# EAGLE design asam1.4 (EAGLE 6.6.0)
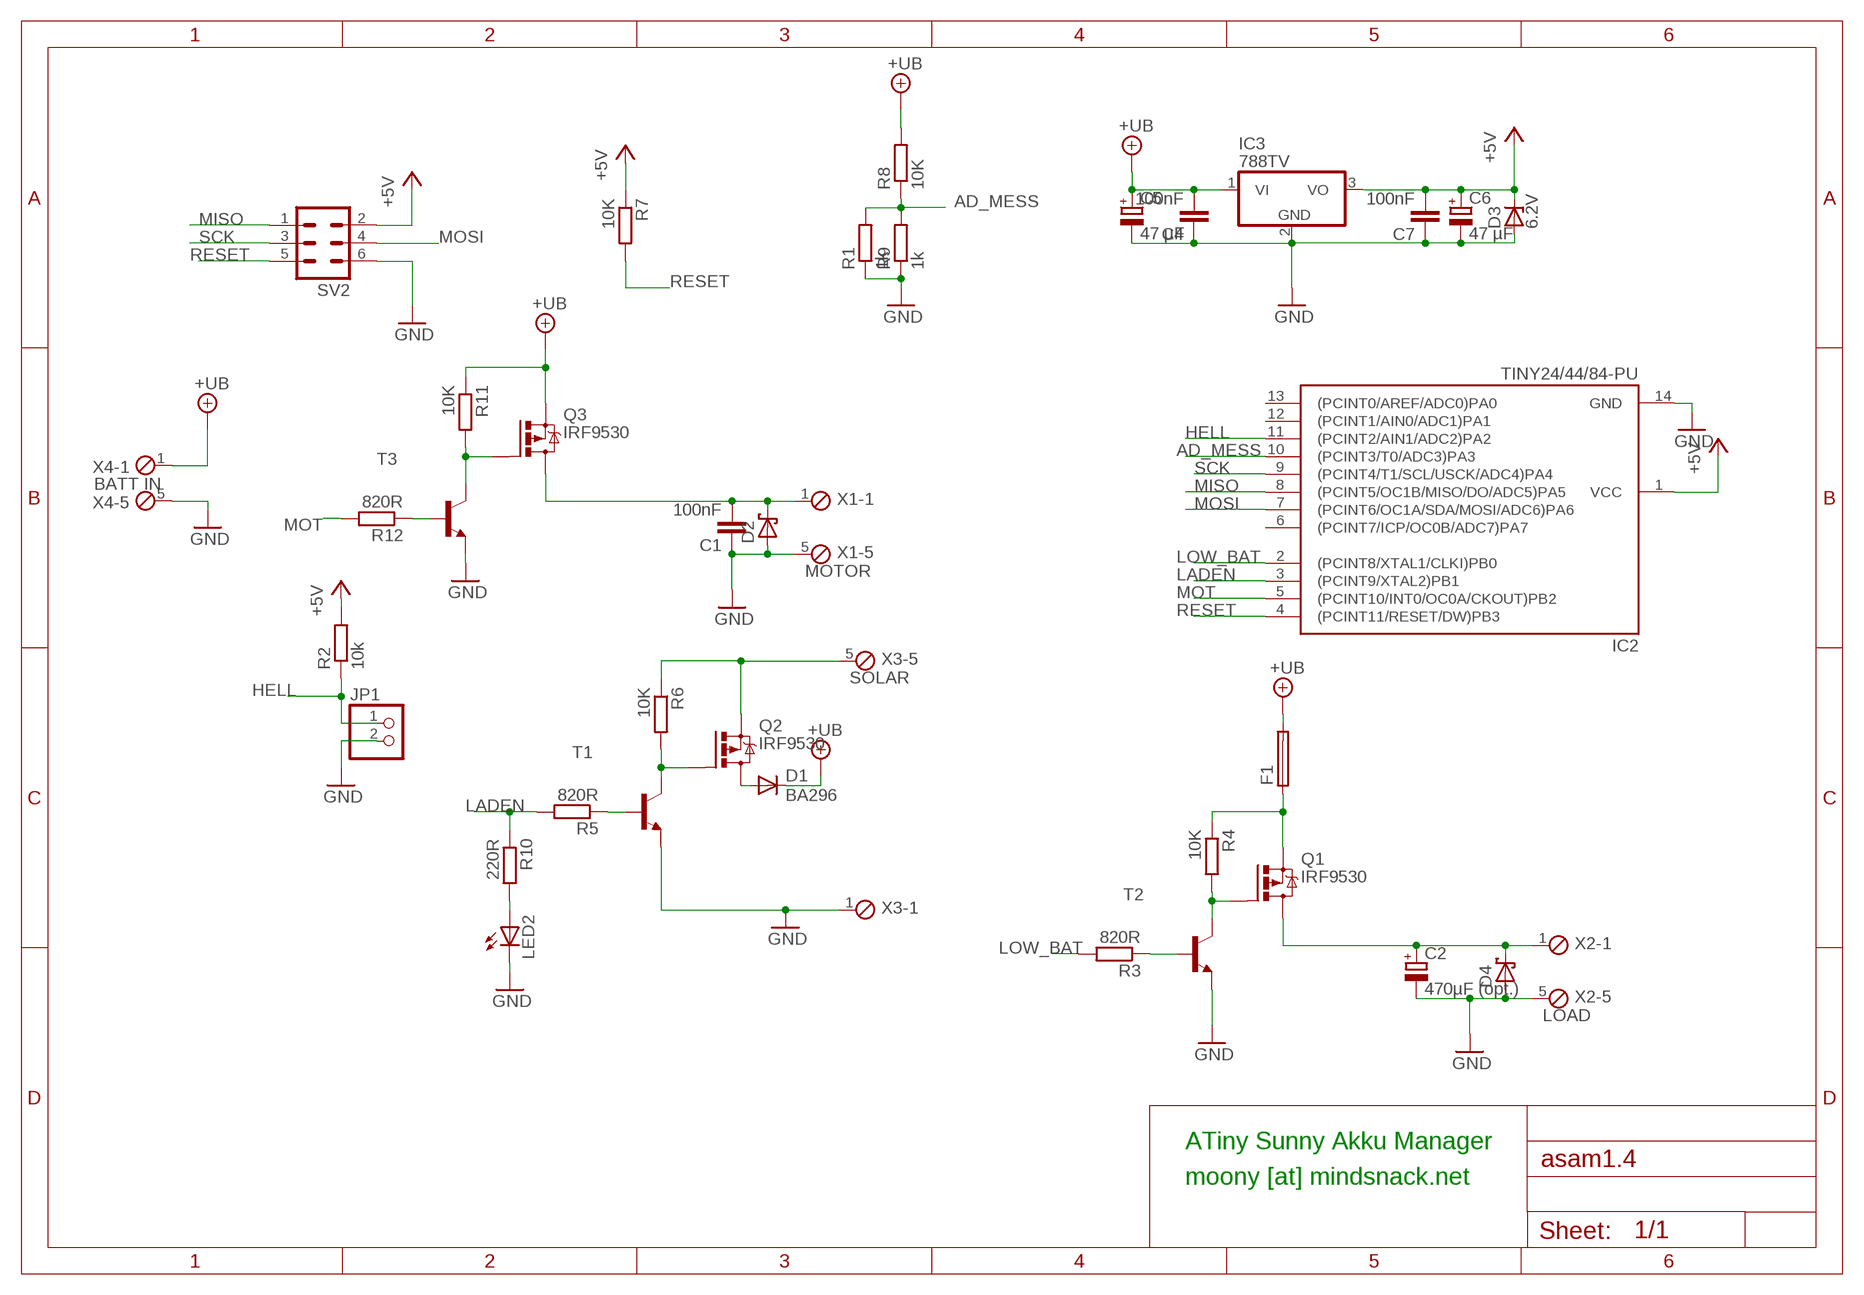
[diagram p0: schematic, sheet 1]

## Parts
C1  100nF  C-EU075-032X103  [C075-032X103]
C2  470µF (opt.)  CPOL-EUE5-10.5  [E5-10,5]
C4  100nF  C-EU075-032X103  [C075-032X103]
C5  47 µF  CPOL-EUE5-10.5  [E5-10,5]
C6  47 µF  CPOL-EUE5-10.5  [E5-10,5]
C7  100nF  C-EU075-032X103  [C075-032X103]
D1  BA296  [P2-15]
D2  SCHOTTKY-DIODEDO35-7  [DO35-7]
D3  6.2V  ZENER-DIODEC1702-15  [C1702-15]
D4  SCHOTTKY-DIODEDO35-7  [DO35-7]
F1  SH22,5  [SH22,5]
IC2  TINY24/44/84-PU  [DIL14]
IC3  788TV  [TO220V]
JP1  PINHD-1X2  [1X02]
LED2  LED3MM  [LED3MM]
Q1  IRF9530  [TO220BV]
Q2  IRF9530  [TO220BV]
Q3  IRF9530  [TO220BV]
R1  1k  R-EU_0207/10  [0207/10]
R2  10k  R-EU_0207/10  [0207/10]
R3  820R  R-EU_0207/10  [0207/10]
R4  10K  R-EU_0207/12  [0207/12]
R5  820R  R-EU_0207/10  [0207/10]
R6  10K  R-EU_0207/12  [0207/12]
R7  10K  R-EU_0207/12  [0207/12]
R8  10K  R-EU_0207/10  [0207/10]
R9  1k  R-EU_0207/10  [0207/10]
R10  220R  R-EU_0207/10  [0207/10]
R11  10K  R-EU_0207/12  [0207/12]
R12  820R  R-EU_0207/10  [0207/10]
SV2  MA03-2  [MA03-2]
T1  BC546-NPN-TO92-CBE  [TO92-CBE]
T2  BC546-NPN-TO92-CBE  [TO92-CBE]
T3  BC546-NPN-TO92-CBE  [TO92-CBE]
X1  MOTOR  MPT5  [5POL254]
X2  LOAD  MPT5  [5POL254]
X3  SOLAR  MPT5  [5POL254]
X4  BATT IN  MPT5  [5POL254]

## Nets
+5V: C6.+ C7.2 D3.C IC2.1(VCC) IC3.3(VO) R2.2 R7.1 SV2.2
+UB: C4.2 C5.+ D1.C F1.2 IC3.1(VI) Q3.S R8.2 R11.1 X4.1
AD_MESS: IC2.10((PCINT3/T0/ADC3)PA3) R1.2 R8.1 R9.2
GND: C1.1 C2.- C4.1 C5.- C6.- C7.1 D2.A D3.A D4.A IC2.14(GND) IC3.2(GND) JP1.2 LED2.K(C) R1.1 R9.1 SV2.6 T1.E T2.E T3.E X1.5 X2.5 X3.1 X4.5
HELL: IC2.11((PCINT2/AIN1/ADC2)PA2) JP1.1 R2.1
LADEN: IC2.3((PCINT9/XTAL2)PB1) R5.2 R10.1
LOW_BAT: IC2.2((PCINT8/XTAL1/CLKI)PB0) R3.2
MISO: IC2.8((PCINT5/OC1B/MISO/DO/ADC5)PA5) SV2.1
MOSI: IC2.7((PCINT6/OC1A/SDA/MOSI/ADC6)PA6) SV2.4
MOT: IC2.5((PCINT10/INT0/OC0A/CKOUT)PB2) R12.2
N$1: C1.2 D2.C Q3.D X1.1
N$2: R3.1 T2.B
N$3: Q1.G R4.2 T2.C
N$4: Q2.S R6.1 X3.5
N$5: Q2.G R6.2 T1.C
N$6: Q3.G R11.2 T3.C
N$7: R5.1 T1.B
N$8: LED2.A R10.2
N$9: D1.A Q2.D
N$10: R12.1 T3.B
N$11: F1.1 Q1.S R4.1
N$18: C2.+ D4.C Q1.D X2.1
RESET: IC2.4((PCINT11/RESET/DW)PB3) R7.2 SV2.5
SCK: IC2.9((PCINT4/T1/SCL/USCK/ADC4)PA4) SV2.3
Unconnected: IC2.6((PCINT7/ICP/OC0B/ADC7)PA7) IC2.12((PCINT1/AIN0/ADC1)PA1) IC2.13((PCINT0/AREF/ADC0)PA0) X1.2 X1.3 X1.4 X2.2 X2.3 X2.4 X3.2 X3.3 X3.4 X4.2 X4.3 X4.4

## Notes on the sheet
- ATiny Sunny Akku Manager
- moony [at] mindsnack.net

## Library data of the parts
C1 C4 C7 = rcl:C-EU: CAPACITOR, European symbol
C2 C5 C6 = rcl:CPOL-EU: POLARIZED CAPACITOR, European symbol
D1 = diode:BA296: DIODE
D2 D4 = diode:SCHOTTKY-DIODE: Schottky Diode
D3 = diode:ZENER-DIODE: Z-Diode
F1 = fuse:SH22,5: FUSE HOLDER grid 22,5 mm, OGN0031 8201, Schurter (Buerklin); MF: SCHURTER; MPN: 0031.8201; OC_FARNELL: 1162740; OC_NEWARK: 96F8317
IC2 = avr-5:TINY24/44/84
IC3 = linear:78*: Positive VOLTAGE REGULATOR Source: http://cache.national.com/ds/LM/LM78L05.pdf http://www.fairchildsemi.com/ds/LM/LM7805.pdf
JP1 = pinhead:PINHD-1X2: PIN HEADER
LED2 = led:LED: LED OSRAM: - CHIPLED LG R971, LG N971, LY N971, LG Q971, LY Q971, LO R971, LY R971 LH N974, LH R974 LS Q976, LO Q976, LY Q976 LO Q996 - Hyper CHIPLED LW Q18S LB Q993, LB Q99A, LB R99A - SideLED LS A670, LO A670, LY A670, LG A670, LP A670 LB A673, LV A673, LT A673, LW A673 LH A674 LY A675 LS A676, LA A676, LO A676, LY A676, LW A676 LS A679, LY A679, LG A679 - Hyper Micro SIDELED® LS Y876, LA Y876, LO Y876, LY Y876 LT Y87S - SmartLED LW L88C, LW L88S LB L89C, LB L89S, LG L890 LS L89K, LO L89K, LY L89K LS L896, LA L896, LO L896, LY L896 - TOPLED LS T670, LO T670, LY T670, LG T670, LP T670 LSG T670, LSP T670, LSY T670, LOP T670, LYG T670 LG T671, LOG T671, LSG T671 LB T673, LV T673, LT T673, LW T673 LH T674 LS T676, LA T676, LO T676, LY T676, LB T676, LH T676, LSB T676, LW T676 LB T67C, LV T67C, LT T67C, LS T67K, LO T67K, LY T67K, LW E67C LS E67B, LA E67B, LO E67B, LY E67B, LB E67C, LV E67C, LT E67C LW T67C LS T679, LY T679, LG T679 LS T770, LO T770, LY T770, LG T770, LP T770 LB T773, LV T773, LT T773, LW T773 LH T774 LS E675, LA E675, LY E675, LS T675 LS T776, LA T776, LO T776, LY T776, LB T776 LHGB T686 LT T68C, LB T68C - Hyper Mini TOPLED® LB M676 - Mini TOPLED Santana® LG M470 LS M47K, LO M47K, LY M47K Source: http://www.osram.convergy.de LUXEON: - LUMILED® LXK2-PW12-R00, LXK2-PW12-S00, LXK2-PW14-U00, LXK2-PW14-V00 LXK2-PM12-R00, LXK2-PM12-S00, LXK2-PM14-U00 LXK2-PE12-Q00, LXK2-PE12-R00, LXK2-PE12-S00, LXK2-PE14-T00, LXK2-PE14-U00 LXK2-PB12-K00, LXK2-PB12-L00, LXK2-PB12-M00, LXK2-PB14-N00, LXK2-PB14-P00, LXK2-PB14-Q00 LXK2-PR12-L00, LXK2-PR12-M00, LXK2-PR14-Q00, LXK2-PR14-R00 LXK2-PD12-Q00, LXK2-PD12-R00, LXK2-PD12-S00 LXK2-PH12-R00, LXK2-PH12-S00 LXK2-PL12-P00, LXK2-PL12-Q00, LXK2-PL12-R00 Source: www.luxeon.com KINGBRIGHT: KA-3528ASYC Source: www.kingbright.com
Q1-Q3 = transistor-power:IRF9530: P-CHANNEL HEXFET POWER-MOS-FET Source: http://www.irf.com/product-info/datasheets/data/irf9530.pdf
R1-R12 = rcl:R-EU_: RESISTOR, European symbol
SV2 = con-lstb:MA03-2: PIN HEADER; OC_FARNELL: unknown; OC_NEWARK: unknown
T1-T3 = transistor:*-NPN-: NPN Transistror BF959 corrected 2008.03.06
X1-X4 = con-phoenix-254:MPT5: PHOENIX CONNECTOR; OC_FARNELL: unknown; OC_NEWARK: unknown

## Board
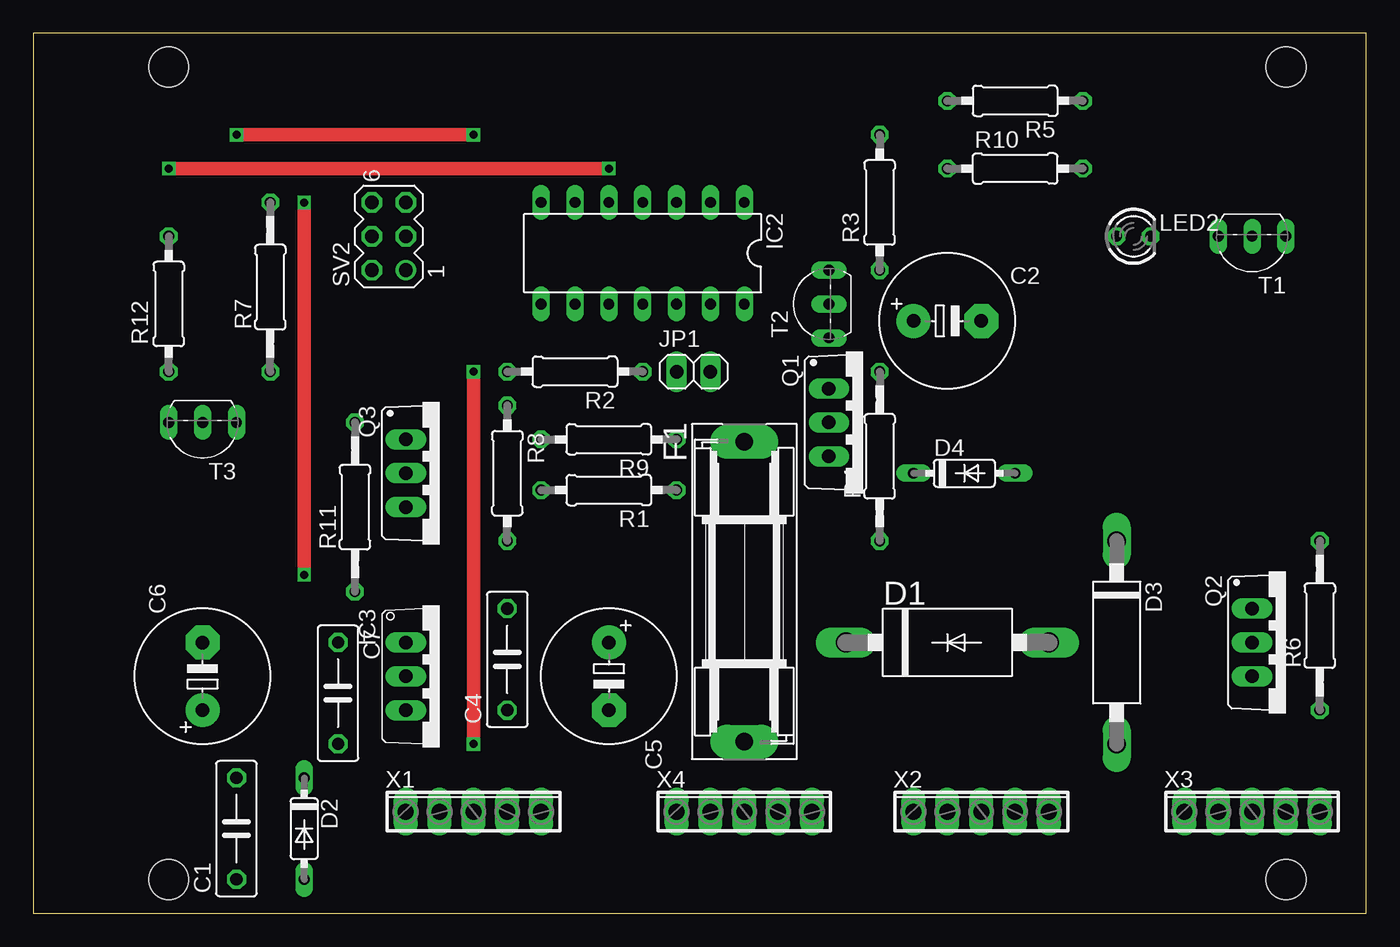
[diagram p1: board, top side]
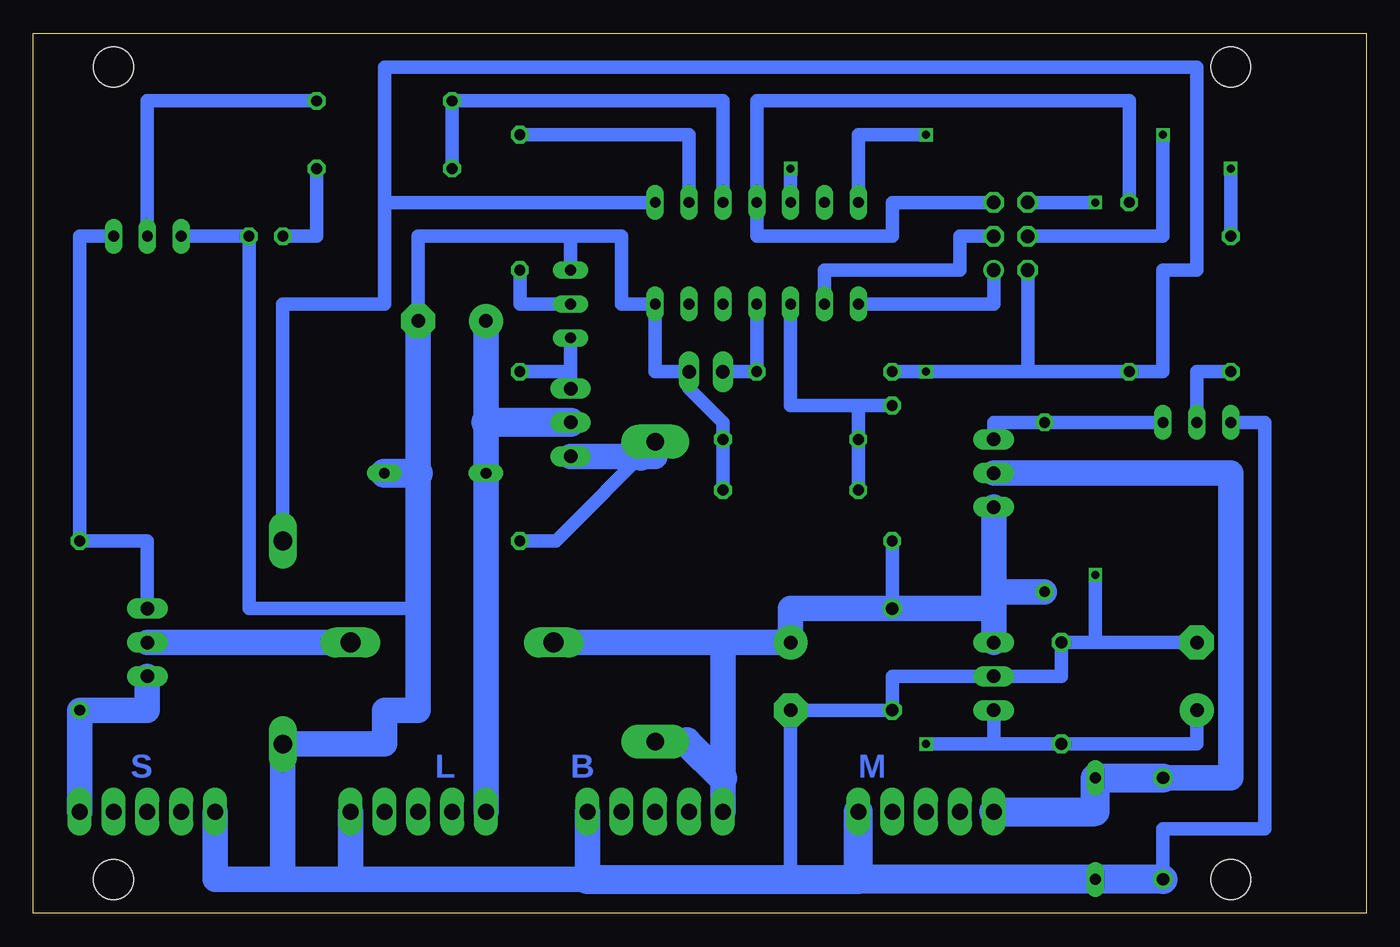
[diagram p2: board, bottom side, seen from below]

Size 100 x 66.03 mm. Coordinates in mm from the lower left corner, seen from the top.
Outline: 0,0 100,0 100,66.03 0,66.03 0,0
Copper layers (1*16): Top 0.035mm / dielectric 1.5mm / Bottom 0.035mm
Design rules "default": minimum track width 10mil, minimum drill 24mil, track to track 8mil, track to pad 8mil, pad to pad 8mil, via to via 8mil, smd to smd 8mil, copper to edge 40mil, drill to drill 8mil, minimum pad ring 10mil, minimum via ring 8mil, stop-mask expansion 4mil, vias tented up to drill 0mil, thermal gap 10mil
Holes 3 mm at 10.16,2.54 10.16,63.5 93.98,63.5 93.98,2.54

### Footprints (pad centres in the part's own frame; a part is rotated, then mirrored left to right if it is on the bottom)
C075-032X103 = drill 0.914 octagon: 1 -3.81,0; 2 3.81,0
E5-10,5 = drill 1.016 pad 2.54: + -2.54,0 | drill 1.016 pad 2.54 octagon: - 2.54,0
P2-15 = drill 1.499 long: A 7.62,0; C -7.62,0
DO35-7 = drill 0.813 long: A 3.81,0; C -3.81,0
C1702-15 = drill 1.397 long: A 7.62,0; C -7.62,0
SH22,5 = drill 1.321 pad 2.54 long: 1 -11.252,0; 2 11.252,0
DIL14 = drill 0.813 long: 1 -7.62,-3.81; 2 -5.08,-3.81; 3 -2.54,-3.81; 4 0,-3.81; 5 2.54,-3.81; 6 5.08,-3.81; 7 7.62,-3.81; 8 7.62,3.81; 9 5.08,3.81; 10 2.54,3.81; 11 0,3.81; 12 -2.54,3.81; 13 -5.08,3.81; 14 -7.62,3.81
TO220V = drill 1.016 long: 1 -2.54,-2.54; 2 0,-2.54; 3 2.54,-2.54
1X02 = drill 1.016 long: 1 -1.27,0; 2 1.27,0
LED3MM = drill 0.813 octagon: A -1.27,0; K 1.27,0
TO220BV = drill 1.016 long: D 0,-2.54; G -2.54,-2.54; S 2.54,-2.54
0207/10 = drill 0.813 octagon: 1 -5.08,0; 2 5.08,0
0207/12 = drill 0.813 octagon: 1 -6.35,0; 2 6.35,0
MA03-2 = drill 1.016: 1 -2.54,-1.27 | drill 1.016 octagon: 2 -2.54,1.27; 3 0,-1.27; 4 0,1.27; 5 2.54,-1.27; 6 2.54,1.27
TO92-CBE = drill 0.813 long: B 0,0; C -2.54,0; E 2.54,0
5POL254 = drill 1.2 long: 1 -5.08,0; 2 -2.54,0; 3 0,0; 4 2.54,0; 5 5.08,0

### Placement (x,y rotation side)
C1  15.24,6.35 90 top
C2  68.58,44.45 0 top
C4  35.56,19.05 90 top
C5  43.18,17.78 270 top
C6  12.7,17.78 90 top
C7  22.86,16.51 270 top
D1  68.58,20.32 0 top
D2  20.32,6.35 270 top
D3  81.28,20.32 270 top
D4  69.85,33.02 0 top
F1  53.34,24.13 270 top
IC2  45.72,49.53 180 top
IC3  30.48,17.78 270 top
JP1  49.53,40.64 0 top
LED2  82.55,50.8 0 top
Q1  62.23,36.83 270 top
Q2  93.98,20.32 270 top
Q3  30.48,33.02 270 top
R1  43.18,31.75 180 top
R2  40.64,40.64 180 top
R3  63.5,53.34 90 top
R4  63.5,34.29 90 top
R5  73.66,60.96 180 top
R6  96.52,21.59 90 top
R7  17.78,46.99 90 top
R8  35.56,33.02 270 top
R9  43.18,35.56 180 top
R10  73.66,55.88 0 top
R11  24.13,30.48 90 top
R12  10.16,45.72 90 top
SV2  26.67,50.8 90 top
T1  91.44,50.8 180 top
T2  59.69,45.72 90 top
T3  12.7,36.83 180 top
X1  33.02,7.62 0 top
X2  71.12,7.62 0 top
X3  91.44,7.62 0 top
X4  53.34,7.62 0 top

### Tracks (layer width: path | path; a pad name or v marks a point on that pad's centre or on a via)
+5V  (via drill 0.6)
  Top 1.016: v33.02,12.7 v33.02,40.64
  Bottom 1.016: D3.C 81.28,45.72 73.66,45.72 73.66,53.34 | IC3.3 27.94,12.7 | 27.94,12.7 C7.2 12.7,12.7 C6.+ | 25.4,40.64 SV2.2 | IC2.1 73.66,53.34 | 73.66,53.34 73.66,63.5 12.7,63.5 12.7,48.26 15.24,48.26 15.24,40.64 R7.1 25.4,40.64 | v33.02,12.7 27.94,12.7 | 25.4,40.64 v33.02,40.64 R2.2
+UB
  Bottom 1.016: R8.2 C4.2
  Bottom 1.93: D1.C 48.26,20.32 | 48.26,20.32 48.26,10.16 X4.1 | Q3.S 27.94,24.13 | 27.94,24.13 27.94,22.86 | 27.94,22.86 IC3.1 | 48.26,20.32 C5.+ 43.18,22.86 C4.2 27.94,22.86 | R11.1 27.94,24.13
  Bottom 2.184: F1.2 50.98,12.88 48.26,10.16
AD_MESS
  Bottom 1.016: IC2.10 43.18,38.1 38.1,38.1 | R8.1 38.1,38.1 | R1.2 R9.2 38.1,38.1
GND  (via drill 0.6)
  Top 1.016: v20.32,53.34 v20.32,25.4
  Bottom 1.016: 71.12,22.86 83.82,22.86 LED2.K T1.E | 43.18,2.54 C5.- C4.1 35.56,17.78 IC3.2 22.86,17.78 C7.1 20.32,20.32 | 20.32,20.32 C6.- | SV2.6 v20.32,53.34 | v20.32,25.4 20.32,20.32 | R1.1 R9.1 48.26,36.83 50.8,39.37 JP1.2 53.34,40.64 IC2.14 55.88,45.72 55.88,50.8 59.69,50.8 | C2.- 71.12,50.8 59.69,50.8 | T2.E 59.69,50.8 | T3.E 7.62,36.83 7.62,6.35 15.24,6.35 C1.1
  Bottom 1.93: X3.1 86.36,2.54 81.28,2.54 | 81.28,2.54 76.2,2.54 | 76.2,2.54 58.42,2.54 X4.5 | X2.5 76.2,2.54 | 81.28,2.54 D3.A 73.66,12.7 73.66,15.24 71.12,15.24 71.12,22.86 71.12,33.02 C2.-
  Bottom 2.184: 58.42,2.54 43.18,2.54 38.1,2.54 | 38.1,2.54 X1.5 | C1.1 D2.A 38.1,2.54 | D4.A 71.12,33.02
HELL
  Bottom 1.016: IC2.11 R2.1 JP1.1
LADEN
  Bottom 1.016: R10.1 R5.2 48.26,60.96 IC2.3
LOW_BAT
  Bottom 1.016: R3.2 50.8,58.42 IC2.2
MISO
  Bottom 1.016: IC2.8 27.94,45.72 SV2.1
MOSI  (via drill 0.6)
  Top 1.016: v33.02,58.42 v15.24,58.42
  Bottom 1.016: IC2.7 38.1,58.42 v33.02,58.42 | v15.24,58.42 15.24,50.8 SV2.4
MOT  (via drill 0.6)
  Top 1.016: v43.18,55.88 v10.16,55.88
  Bottom 1.016: IC2.5 v43.18,55.88 | v10.16,55.88 R12.2
N$1
  Bottom 1.93: Q3.D 10.16,33.02 10.16,10.16 C1.2
  Bottom 2.184: X1.1 20.32,7.62 D2.C C1.2
N$2
  Bottom 1.016: R3.1 63.5,45.72 T2.B
N$3
  Bottom 1.016: T2.C 59.69,40.64 | 59.69,40.64 Q1.G | R4.2 59.69,40.64
N$4
  Bottom 1.93: X3.5 R6.1 91.44,15.24 Q2.S
N$5
  Bottom 1.016: T1.C 96.52,50.8 R6.2 91.44,27.94 Q2.G
N$6
  Bottom 1.016: T3.C R11.2 27.94,36.83 Q3.G
N$7
  Bottom 1.016: R5.1 91.44,60.96 T1.B
N$8
  Bottom 1.016: R10.2 78.74,50.8 LED2.A
N$9
  Bottom 1.93: Q2.D D1.A
N$10
  Bottom 1.016: R12.1 12.7,40.64 T3.B
N$11
  Bottom 1.016: R4.1 60.78,27.94 F1.1
  Bottom 1.93: Q1.S 53.34,34.29 F1.1
  Bottom 2.184: 54.43,34.29 F1.1
N$18
  Bottom 1.93: X2.1 D4.C | D4.C 66.04,30.48 | C2.+ 66.04,36.83 D4.C
  Bottom 2.184: Q1.D 66.04,36.83
RESET
  Bottom 1.016: R7.2 17.78,60.96 45.72,60.96 IC2.4 45.72,50.8 35.56,50.8 35.56,53.34 SV2.5
SCK
  Bottom 1.016: SV2.3 30.48,50.8 30.48,48.26 40.64,48.26 IC2.9

### Text on the board
Bottom: M | B | L | S